# Altium schematic sheet M.SchDoc
size A
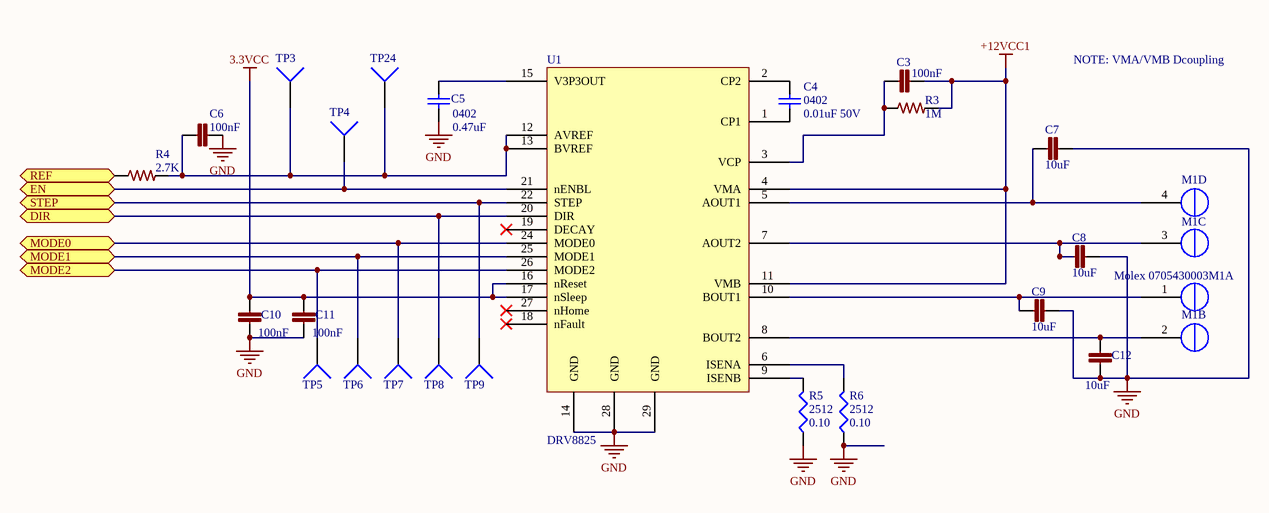
[diagram p0: M.SchDoc]

## Parts
C3  100nF  [C0603]
C4  value 0.01uF 50V  [C0402]  (hidden comment: 0402)
C5  value 0.47uF  [C0402]  (hidden comment: 0402)
C6  100nF  [C0402]
C7  10uF  [C0603]
C8  10uF  [C0603]
C9  10uF  [C0603]
C10  100nF  [C0402]
C11  100nF  [C0402]
C12  10uF  [C0603]
M1  Molex 0705430003  [4POL254]  (parts A,B,C,D of 4)
R3  1M  [R0402]
R4  2.7K  [R0402]
R5  2512  value 0.10  [2512R-0.55]
R6  2512  value 0.10  [2512R-0.55]
TP3  TP4  [TP-2]  (value not drawn)
TP4  TP4  [TP-2]  (value not drawn)
TP5  TP4  [TP-2]  (value not drawn)
TP6  TP4  [TP-2]  (value not drawn)
TP7  TP4  [TP-2]  (value not drawn)
TP8  TP4  [TP-2]  (value not drawn)
TP9  TP4  [TP-2]  (value not drawn)
TP24  TP4  [TP-2]  (value not drawn)
U1  DRV8825  [DRV8825PWPR]

## Ports
DIR, EN, MODE0, MODE1, MODE2, REF, STEP

## Nets
3.3VCC: C10.1 C11.1 U1.16(nReset) U1.17(nSleep)
+12VCC1: C3.2 R3.2 U1.4(VMA) U1.11(VMB)
GND: C5.1 C6.1 C7.2 C8.2 C9.2 C10.2 C11.2 C12.2 R5.1 R6.1 U1.14(GND) U1.28(GND) U1.29(GND)
DIR: TP8.1 U1.20(DIR) ; port DIR
EN: TP4.1 U1.21(nENBL) ; port EN
MODE0: TP7.1 U1.24(MODE0) ; port MODE0
MODE1: TP6.1 U1.25(MODE1) ; port MODE1
MODE2: TP5.1 U1.26(MODE2) ; port MODE2
REF: R4.1 ; port REF
STEP: TP9.1 U1.22(STEP) ; port STEP
NetC3_1: C3.1 R3.1 U1.3(VCP)
NetC4_1: C4.1 U1.1(CP1)
NetC4_2: C4.2 U1.2(CP2)
NetC5_2: C5.2 U1.15(V3P3OUT)
NetC6_2: C6.2 R4.2 TP3.1 TP24.1 U1.12(AVREF) U1.13(BVREF)
NetC7_1: C7.1 M1.4(OUT1B) U1.5(AOUT1)
NetC8_1: C8.1 M1.3(OUT1A) U1.7(AOUT2)
NetC9_1: C9.1 M1.1(OUT2B) U1.10(BOUT1)
NetC12_1: C12.1 M1.2(OUT2A) U1.8(BOUT2)
NetR5_2: R5.2 U1.9(ISENB)
NetR6_2: R6.2 U1.6(ISENA)

Not connected (* = marked no-connect by the designer): U1 18(nFault)* 19(DECAY)* 23(NC) 27(nHome)*

## Notes on the sheet
- NOTE: VMA/VMB Dcoupling

## Library data of the parts
C3 = C0603C104K5RACTU: CAP CER 0603 100nF 50V 10% X7R; LastRevisionNote: ImportComponents; Published: 23-Apr-2014; Publisher: UltiMachine; LastRevisionDate: 23-Apr-2014; ManufacturerPartNumber: C0603C104K5RACTU; VALUE: 100nF
C4 = GRM155R71H103JA88D: CAP CER 10000PF 50V X7R 0402; MFR: Murata; Tolerance: 10%; Voltage: 6.3VDC; Published: 10 - Dec - 2014; LatestRevisionDate: 10 - Dec - 2014; LatestRevisionNote: Ultimachine Footprint Added; Publisher: Ultimachine; Component Type: Chip Capacitor; MFR Part #: GRM155R71H103JA88D; Part Description: CAP CER 10000PF 50V X7R 0402; Mounting Type: SMT 0402; Datasheet: http://search.murata.co.jp/Ceramy/image/img/A01X/G101/ENG/GRM155R71H103JA88-01.pdf; Height: 0.5 ±0.05mm; Digikey #: 490-7763-1-ND; PackageReference: 0402
C5 = GRM155R60J474KE19D: 0.47uF 6.3v C0402 - GRM155R60J474KE19D; MFR: Murata; Part Description: CAP CER 0.47UF 6.3V 10% X5R 0402; Tolerance: 10%; Voltage: 6.3VDC; Published: 10 - Dec - 2014; LatestRevisionDate: 10 - Dec - 2014; LatestRevisionNote: Ultimachine Footprint Added; Publisher: Ultimachine; Component Type: Chip Capacitor; MFR Part #: GRM155R60J474KE19D; Mounting Type: SMT 0402; Datasheet: http://search.murata.co.jp/Ceramy/image/img/A01X/G101/ENG/GRM155R60J474KE19-01.pdf; Height: 0.5 ±0.05mm; PackageReference: 0402
C6 C10 C11 = GRM155R71C104KA88D: CAP CER 0402 100nF 16V 10% X7R; LastRevisionNote: ImportComponents; Published: 23-Apr-2014; Publisher: UltiMachine; LastRevisionDate: 23-Apr-2014; ManufacturerPartNumber: GRM155R71C104KA88D; VALUE: 100nF
C7-C9 C12 = CC0603ZRY5V6BB105: CAP CER 0603 1uF 10V Y5V; LastRevisionNote: ImportComponents; Published: 23-Apr-2014; Publisher: UltiMachine; LastRevisionDate: 23-Apr-2014; ManufacturerPartNumber: CC0603ZRY5V6BB105; VALUE: 10uF
M1 = Molex 0705430003 Alt: Molex 4 Pin Clip Connector
R3 = ERJ2GEJ105X: RES 0402 1M 100mW 5%; LastRevisionNote: ImportComponents; Published: 23-Apr-2014; Publisher: UltiMachine; LastRevisionDate: 23-Apr-2014; ManufacturerPartNumber: ERJ2GEJ105X; VALUE: 1M
R4 = ERJ-2RKF2701X: RES SMD 2.7K OHM 1% 1/10W 0402; Manufacturer: Panasonic; ManufacturerPartNumber: ERJ2GEJ105X; LastRevisionNote: ImportComponents; Published: 23-Apr-2014; Publisher: Adam; LastRevisionDate: 23-Apr-2014; VALUE: 2.7K
R5 R6 = CSRN2512FTR100: RES SMD 0.1 OHM 1% 2W 2512; MFR: Stackpole ELectronics Inc; PackageReference: 2512; MFR #: CSRN2512FTR100; Digikey #: CSRN2512FTR100TR-ND; PDF: http://www.seielect.com/catalog/SEI-CSR_CSRN.pdf
TP3-TP9 TP24 = Socket: LatestRevisionDate: 17-Jul-2002; LatestRevisionNote: Re-released for DXP Platform.; Publisher: Altium Limited
U1 = DRV8825: DRV8825 Ti Stepper Driver; Manufacture: Texas Instruments; Mountining Type: SMD - Ti PowerPAD Package; Voltage: 8.2-45VDC; Cost (1000 qty): 2.25; Part Number: DRV8825PWPR; Status: In-Production; Pins: 28 Pins and one Exposed Pad; Datasheet: http://www.ti.com/lit/gpn/drv8825; Height: 1.2mm; Tolerance: N/A; Type: Stepper Driver - Integrated Circuit; Lead Free: YES